# Altium schematic sheet FMC_HPC_400.SchDoc: FMC P1 400 Pin
size A3
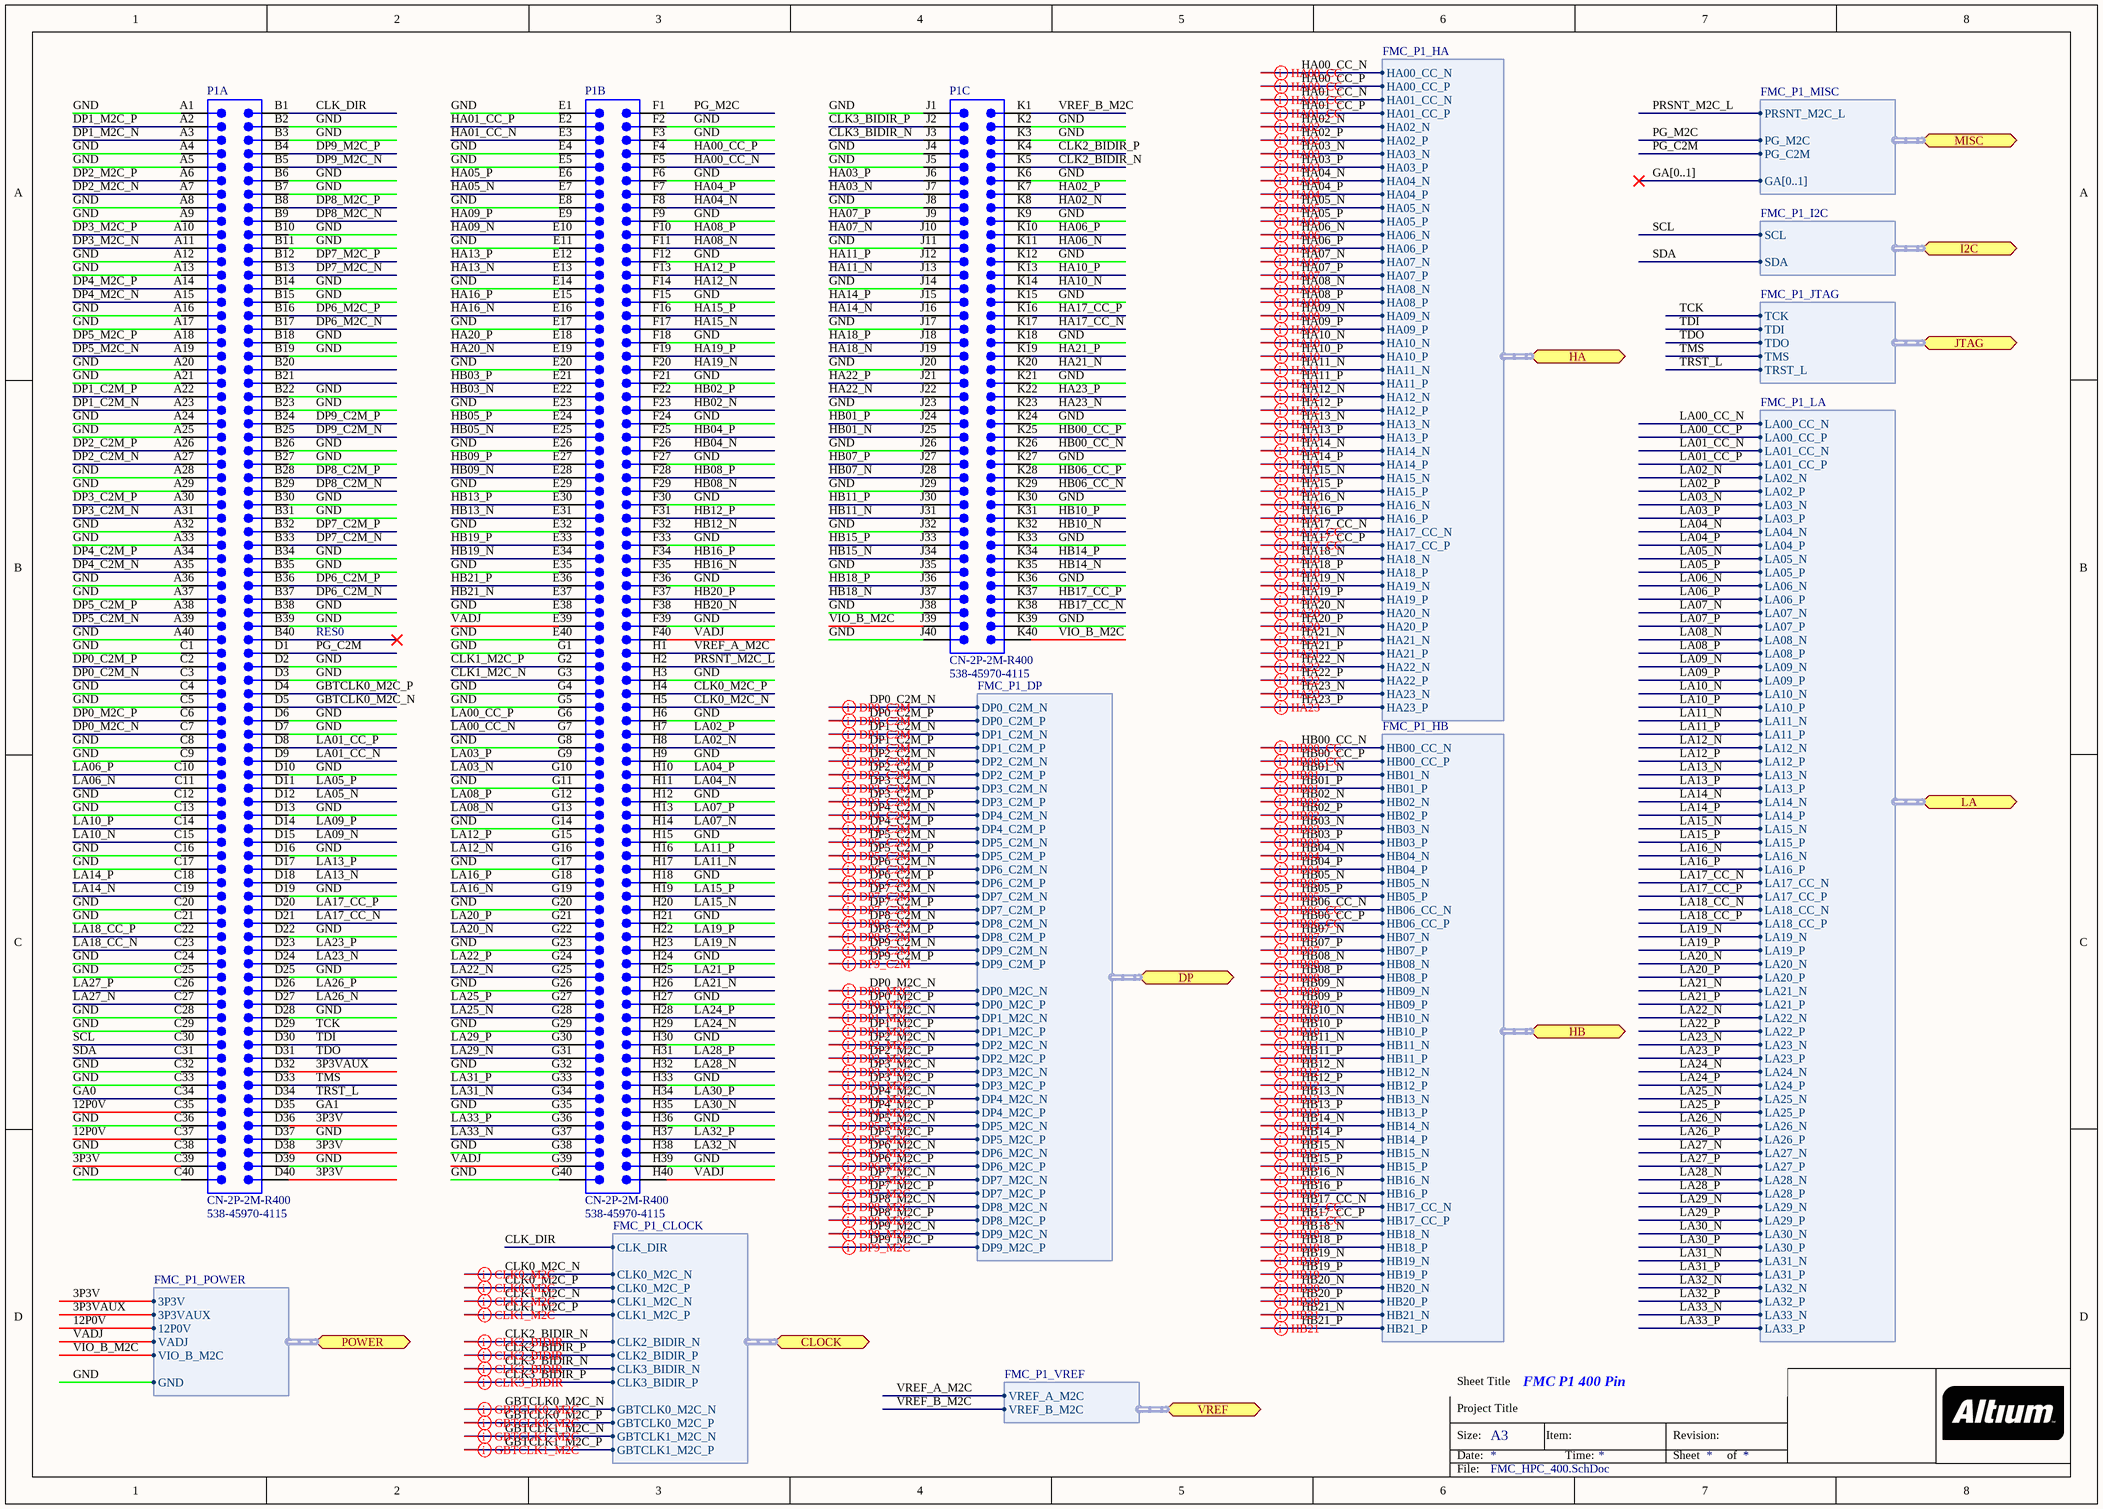
[diagram p0: FMC_HPC_400.SchDoc]

## Parts
P1  CN-2P-2M-R400  Supplier Part Number 1: 538-45970-4115  [BTB-SM1-27-2V400M]  (parts A,B,C of 3)

## Ports
CLOCK (harness FMC_P1_CLOCK), DP (harness FMC_P1_DP), HA (harness FMC_P1_HA), HB (harness FMC_P1_HB), I2C (harness FMC_P1_I2C), JTAG (harness FMC_P1_JTAG), LA (harness FMC_P1_LA), MISC (harness FMC_P1_MISC), POWER (harness FMC_P1_POWER), VREF (harness FMC_P1_VREF)

## Harnesses
FMC_P1_LA: LA05_N, LA05_P, LA06_N, LA06_P, LA09_N, LA09_P, LA10_N, LA10_P, LA13_N, LA13_P, LA14_N, LA14_P, LA23_N, LA23_P, LA26_N, LA26_P, LA27_N, LA27_P, LA02_N, LA02_P, LA03_N, LA03_P, LA04_N, LA04_P, LA07_N, LA07_P, LA08_N, LA08_P, LA11_N, LA11_P, LA12_N, LA12_P, LA15_N, LA15_P, LA16_N, LA16_P, LA19_N, LA19_P, LA20_N, LA20_P, LA21_N, LA21_P, LA22_N, LA22_P, LA24_N, LA24_P, LA25_N, LA25_P, LA28_N, LA28_P, LA29_N, LA29_P, LA30_N, LA30_P, LA31_N, LA31_P, LA32_N, LA32_P, LA33_N, LA33_P, LA00_CC_N, LA00_CC_P, LA01_CC_N, LA01_CC_P, LA17_CC_N, LA17_CC_P, LA18_CC_N, LA18_CC_P
FMC_P1_MISC: PRSNT_M2C_L, PG_M2C, PG_C2M, GA[0..1]
FMC_P1_POWER: 3P3V, 3P3VAUX, 12P0V, VADJ, VIO_B_M2C, GND
FMC_P1_JTAG: TCK, TDI, TDO, TMS, TRST_L
FMC_P1_I2C: SCL, SDA
FMC_P1_CLOCK: CLK2_BIDIR_N, CLK2_BIDIR_P, CLK3_BIDIR_N, CLK3_BIDIR_P, CLK0_M2C_N, CLK0_M2C_P, CLK1_M2C_N, CLK1_M2C_P, CLK_DIR, GBTCLK0_M2C_N, GBTCLK0_M2C_P, GBTCLK1_M2C_N, GBTCLK1_M2C_P
FMC_P1_VREF: VREF_A_M2C, VREF_B_M2C
FMC_P1_HB: HB02_N, HB02_P, HB03_N, HB03_P, HB04_N, HB04_P, HB05_N, HB05_P, HB08_N, HB08_P, HB09_N, HB09_P, HB12_N, HB12_P, HB13_N, HB13_P, HB16_N, HB16_P, HB19_N, HB19_P, HB20_N, HB20_P, HB21_N, HB21_P, HB01_N, HB01_P, HB07_N, HB07_P, HB10_N, HB10_P, HB11_N, HB11_P, HB14_N, HB14_P, HB15_N, HB15_P, HB18_N, HB18_P, HB17_CC_N, HB17_CC_P, HB06_CC_N, HB06_CC_P, HB00_CC_N, HB00_CC_P
FMC_P1_DP: DP1_C2M_N, DP1_C2M_P, DP1_M2C_N, DP1_M2C_P, DP2_C2M_N, DP2_C2M_P, DP2_M2C_N, DP2_M2C_P, DP3_C2M_N, DP3_C2M_P, DP3_M2C_N, DP3_M2C_P, DP4_C2M_N, DP4_C2M_P, DP4_M2C_N, DP4_M2C_P, DP5_C2M_N, DP5_C2M_P, DP5_M2C_N, DP5_M2C_P, DP6_C2M_N, DP6_C2M_P, DP6_M2C_N, DP6_M2C_P, DP7_C2M_N, DP7_C2M_P, DP7_M2C_N, DP7_M2C_P, DP8_C2M_N, DP8_C2M_P, DP8_M2C_N, DP8_M2C_P, DP9_C2M_N, DP9_C2M_P, DP9_M2C_N, DP9_M2C_P, DP0_C2M_N, DP0_C2M_P, DP0_M2C_N, DP0_M2C_P
FMC_P1_HA: HA04_N, HA04_P, HA05_N, HA05_P, HA08_N, HA08_P, HA09_N, HA09_P, HA12_N, HA12_P, HA13_N, HA13_P, HA15_N, HA15_P, HA16_N, HA16_P, HA19_N, HA19_P, HA20_N, HA20_P, HA02_N, HA02_P, HA03_N, HA03_P, HA06_N, HA06_P, HA07_N, HA07_P, HA10_N, HA10_P, HA11_N, HA11_P, HA14_N, HA14_P, HA18_N, HA18_P, HA21_N, HA21_P, HA22_N, HA22_P, HA23_N, HA23_P, HA17_CC_N, HA17_CC_P, HA00_CC_N, HA00_CC_P, HA01_CC_N, HA01_CC_P

## Nets
3P3V: P1.C39 P1.D36 P1.D38 P1.D40 ; port POWER.3P3V
3P3VAUX: P1.D32 ; port POWER.3P3VAUX
12P0V: P1.C35 P1.C37 ; port POWER.12P0V
CLK0_M2C_N: P1.H5 ; port CLOCK.CLK0_M2C_N
CLK0_M2C_P: P1.H4 ; port CLOCK.CLK0_M2C_P
CLK1_M2C_N: P1.G3 ; port CLOCK.CLK1_M2C_N
CLK1_M2C_P: P1.G2 ; port CLOCK.CLK1_M2C_P
CLK2_BIDIR_N: P1.K5 ; port CLOCK.CLK2_BIDIR_N
CLK2_BIDIR_P: P1.K4 ; port CLOCK.CLK2_BIDIR_P
CLK3_BIDIR_N: P1.J3 ; port CLOCK.CLK3_BIDIR_N
CLK3_BIDIR_P: P1.J2 ; port CLOCK.CLK3_BIDIR_P
CLK_DIR: P1.B1 ; port CLOCK.CLK_DIR
DP0_C2M_N: P1.C3 ; port DP.DP0_C2M_N
DP0_C2M_P: P1.C2 ; port DP.DP0_C2M_P
DP0_M2C_N: P1.C7 ; port DP.DP0_M2C_N
DP0_M2C_P: P1.C6 ; port DP.DP0_M2C_P
DP1_C2M_N: P1.A23 ; port DP.DP1_C2M_N
DP1_C2M_P: P1.A22 ; port DP.DP1_C2M_P
DP1_M2C_N: P1.A3 ; port DP.DP1_M2C_N
DP1_M2C_P: P1.A2 ; port DP.DP1_M2C_P
DP2_C2M_N: P1.A27 ; port DP.DP2_C2M_N
DP2_C2M_P: P1.A26 ; port DP.DP2_C2M_P
DP2_M2C_N: P1.A7 ; port DP.DP2_M2C_N
DP2_M2C_P: P1.A6 ; port DP.DP2_M2C_P
DP3_C2M_N: P1.A31 ; port DP.DP3_C2M_N
DP3_C2M_P: P1.A30 ; port DP.DP3_C2M_P
DP3_M2C_N: P1.A11 ; port DP.DP3_M2C_N
DP3_M2C_P: P1.A10 ; port DP.DP3_M2C_P
DP4_C2M_N: P1.A35 ; port DP.DP4_C2M_N
DP4_C2M_P: P1.A34 ; port DP.DP4_C2M_P
DP4_M2C_N: P1.A15 ; port DP.DP4_M2C_N
DP4_M2C_P: P1.A14 ; port DP.DP4_M2C_P
DP5_C2M_N: P1.A39 ; port DP.DP5_C2M_N
DP5_C2M_P: P1.A38 ; port DP.DP5_C2M_P
DP5_M2C_N: P1.A19 ; port DP.DP5_M2C_N
DP5_M2C_P: P1.A18 ; port DP.DP5_M2C_P
DP6_C2M_N: P1.B37 ; port DP.DP6_C2M_N
DP6_C2M_P: P1.B36 ; port DP.DP6_C2M_P
DP6_M2C_N: P1.B17 ; port DP.DP6_M2C_N
DP6_M2C_P: P1.B16 ; port DP.DP6_M2C_P
DP7_C2M_N: P1.B33 ; port DP.DP7_C2M_N
DP7_C2M_P: P1.B32 ; port DP.DP7_C2M_P
DP7_M2C_N: P1.B13 ; port DP.DP7_M2C_N
DP7_M2C_P: P1.B12 ; port DP.DP7_M2C_P
DP8_C2M_N: P1.B29 ; port DP.DP8_C2M_N
DP8_C2M_P: P1.B28 ; port DP.DP8_C2M_P
DP8_M2C_N: P1.B9 ; port DP.DP8_M2C_N
DP8_M2C_P: P1.B8 ; port DP.DP8_M2C_P
DP9_C2M_N: P1.B25 ; port DP.DP9_C2M_N
DP9_C2M_P: P1.B24 ; port DP.DP9_C2M_P
DP9_M2C_N: P1.B5 ; port DP.DP9_M2C_N
DP9_M2C_P: P1.B4 ; port DP.DP9_M2C_P
GA0: P1.C34
GA1: P1.D35
GBTCLK0_M2C_N: P1.D5 ; port CLOCK.GBTCLK0_M2C_N
GBTCLK0_M2C_P: P1.D4 ; port CLOCK.GBTCLK0_M2C_P
GBTCLK1_M2C_N: port CLOCK.GBTCLK1_M2C_N
GBTCLK1_M2C_P: port CLOCK.GBTCLK1_M2C_P
GND: P1.A1 P1.A4 P1.A5 P1.A8 P1.A9 P1.A12 P1.A13 P1.A16 P1.A17 P1.A20 P1.A21 P1.A24 P1.A25 P1.A28 P1.A29 P1.A32 P1.A33 P1.A36 P1.A37 P1.A40 P1.B2 P1.B3 P1.B6 P1.B7 P1.B10 P1.B11 P1.B14 P1.B15 P1.B18 P1.B19 P1.B22 P1.B23 P1.B26 P1.B27 P1.B30 P1.B31 P1.B34 P1.B35 P1.B38 P1.B39 P1.C1 P1.C4 P1.C5 P1.C8 P1.C9 P1.C12 P1.C13 P1.C16 P1.C17 P1.C20 P1.C21 P1.C24 P1.C25 P1.C28 P1.C29 P1.C32 P1.C33 P1.C36 P1.C38 P1.C40 P1.D2 P1.D3 P1.D6 P1.D7 P1.D10 P1.D13 P1.D16 P1.D19 P1.D22 P1.D25 P1.D28 P1.D37 P1.D39 P1.E1 P1.E4 P1.E5 P1.E8 P1.E11 P1.E14 P1.E17 P1.E20 P1.E23 P1.E26 P1.E29 P1.E32 P1.E35 P1.E38 P1.E40 P1.F2 P1.F3 P1.F6 P1.F9 P1.F12 P1.F15 P1.F18 P1.F21 P1.F24 P1.F27 P1.F30 P1.F33 P1.F36 P1.F39 P1.G1 P1.G4 P1.G5 P1.G8 P1.G11 P1.G14 P1.G17 P1.G20 P1.G23 P1.G26 P1.G29 P1.G32 P1.G35 P1.G38 P1.G40 P1.H3 P1.H6 P1.H9 P1.H12 P1.H15 P1.H18 P1.H21 P1.H24 P1.H27 P1.H30 P1.H33 P1.H36 P1.H39 P1.J1 P1.J4 P1.J5 P1.J8 P1.J11 P1.J14 P1.J17 P1.J20 P1.J23 P1.J26 P1.J29 P1.J32 P1.J35 P1.J38 P1.J40 P1.K2 P1.K3 P1.K6 P1.K9 P1.K12 P1.K15 P1.K18 P1.K21 P1.K24 P1.K27 P1.K30 P1.K33 P1.K36 P1.K39 ; port POWER.GND
HA00_CC_N: P1.F5 ; port HA.HA00_CC_N
HA00_CC_P: P1.F4 ; port HA.HA00_CC_P
HA01_CC_N: P1.E3 ; port HA.HA01_CC_N
HA01_CC_P: P1.E2 ; port HA.HA01_CC_P
HA02_N: P1.K8 ; port HA.HA02_N
HA02_P: P1.K7 ; port HA.HA02_P
HA03_N: P1.J7 ; port HA.HA03_N
HA03_P: P1.J6 ; port HA.HA03_P
HA04_N: P1.F8 ; port HA.HA04_N
HA04_P: P1.F7 ; port HA.HA04_P
HA05_N: P1.E7 ; port HA.HA05_N
HA05_P: P1.E6 ; port HA.HA05_P
HA06_N: P1.K11 ; port HA.HA06_N
HA06_P: P1.K10 ; port HA.HA06_P
HA07_N: P1.J10 ; port HA.HA07_N
HA07_P: P1.J9 ; port HA.HA07_P
HA08_N: P1.F11 ; port HA.HA08_N
HA08_P: P1.F10 ; port HA.HA08_P
HA09_N: P1.E10 ; port HA.HA09_N
HA09_P: P1.E9 ; port HA.HA09_P
HA10_N: P1.K14 ; port HA.HA10_N
HA10_P: P1.K13 ; port HA.HA10_P
HA11_N: P1.J13 ; port HA.HA11_N
HA11_P: P1.J12 ; port HA.HA11_P
HA12_N: P1.F14 ; port HA.HA12_N
HA12_P: P1.F13 ; port HA.HA12_P
HA13_N: P1.E13 ; port HA.HA13_N
HA13_P: P1.E12 ; port HA.HA13_P
HA14_N: P1.J16 ; port HA.HA14_N
HA14_P: P1.J15 ; port HA.HA14_P
HA15_N: P1.F17 ; port HA.HA15_N
HA15_P: P1.F16 ; port HA.HA15_P
HA16_N: P1.E16 ; port HA.HA16_N
HA16_P: P1.E15 ; port HA.HA16_P
HA17_CC_N: P1.K17 ; port HA.HA17_CC_N
HA17_CC_P: P1.K16 ; port HA.HA17_CC_P
HA18_N: P1.J19 ; port HA.HA18_N
HA18_P: P1.J18 ; port HA.HA18_P
HA19_N: P1.F20 ; port HA.HA19_N
HA19_P: P1.F19 ; port HA.HA19_P
HA20_N: P1.E19 ; port HA.HA20_N
HA20_P: P1.E18 ; port HA.HA20_P
HA21_N: P1.K20 ; port HA.HA21_N
HA21_P: P1.K19 ; port HA.HA21_P
HA22_N: P1.J22 ; port HA.HA22_N
HA22_P: P1.J21 ; port HA.HA22_P
HA23_N: P1.K23 ; port HA.HA23_N
HA23_P: P1.K22 ; port HA.HA23_P
HB00_CC_N: P1.K26 ; port HB.HB00_CC_N
HB00_CC_P: P1.K25 ; port HB.HB00_CC_P
HB01_N: P1.J25 ; port HB.HB01_N
HB01_P: P1.J24 ; port HB.HB01_P
HB02_N: P1.F23 ; port HB.HB02_N
HB02_P: P1.F22 ; port HB.HB02_P
HB03_N: P1.E22 ; port HB.HB03_N
HB03_P: P1.E21 ; port HB.HB03_P
HB04_N: P1.F26 ; port HB.HB04_N
HB04_P: P1.F25 ; port HB.HB04_P
HB05_N: P1.E25 ; port HB.HB05_N
HB05_P: P1.E24 ; port HB.HB05_P
HB06_CC_N: P1.K29 ; port HB.HB06_CC_N
HB06_CC_P: P1.K28 ; port HB.HB06_CC_P
HB07_N: P1.J28 ; port HB.HB07_N
HB07_P: P1.J27 ; port HB.HB07_P
HB08_N: P1.F29 ; port HB.HB08_N
HB08_P: P1.F28 ; port HB.HB08_P
HB09_N: P1.E28 ; port HB.HB09_N
HB09_P: P1.E27 ; port HB.HB09_P
HB10_N: P1.K32 ; port HB.HB10_N
HB10_P: P1.K31 ; port HB.HB10_P
HB11_N: P1.J31 ; port HB.HB11_N
HB11_P: P1.J30 ; port HB.HB11_P
HB12_N: P1.F32 ; port HB.HB12_N
HB12_P: P1.F31 ; port HB.HB12_P
HB13_N: P1.E31 ; port HB.HB13_N
HB13_P: P1.E30 ; port HB.HB13_P
HB14_N: P1.K35 ; port HB.HB14_N
HB14_P: P1.K34 ; port HB.HB14_P
HB15_N: P1.J34 ; port HB.HB15_N
HB15_P: P1.J33 ; port HB.HB15_P
HB16_N: P1.F35 ; port HB.HB16_N
HB16_P: P1.F34 ; port HB.HB16_P
HB17_CC_N: P1.K38 ; port HB.HB17_CC_N
HB17_CC_P: P1.K37 ; port HB.HB17_CC_P
HB18_N: P1.J37 ; port HB.HB18_N
HB18_P: P1.J36 ; port HB.HB18_P
HB19_N: P1.E34 ; port HB.HB19_N
HB19_P: P1.E33 ; port HB.HB19_P
HB20_N: P1.F38 ; port HB.HB20_N
HB20_P: P1.F37 ; port HB.HB20_P
HB21_N: P1.E37 ; port HB.HB21_N
HB21_P: P1.E36 ; port HB.HB21_P
LA00_CC_N: P1.G7 ; port LA.LA00_CC_N
LA00_CC_P: P1.G6 ; port LA.LA00_CC_P
LA01_CC_N: P1.D9 ; port LA.LA01_CC_N
LA01_CC_P: P1.D8 ; port LA.LA01_CC_P
LA02_N: P1.H8 ; port LA.LA02_N
LA02_P: P1.H7 ; port LA.LA02_P
LA03_N: P1.G10 ; port LA.LA03_N
LA03_P: P1.G9 ; port LA.LA03_P
LA04_N: P1.H11 ; port LA.LA04_N
LA04_P: P1.H10 ; port LA.LA04_P
LA05_N: P1.D12 ; port LA.LA05_N
LA05_P: P1.D11 ; port LA.LA05_P
LA06_N: P1.C11 ; port LA.LA06_N
LA06_P: P1.C10 ; port LA.LA06_P
LA07_N: P1.H14 ; port LA.LA07_N
LA07_P: P1.H13 ; port LA.LA07_P
LA08_N: P1.G13 ; port LA.LA08_N
LA08_P: P1.G12 ; port LA.LA08_P
LA09_N: P1.D15 ; port LA.LA09_N
LA09_P: P1.D14 ; port LA.LA09_P
LA10_N: P1.C15 ; port LA.LA10_N
LA10_P: P1.C14 ; port LA.LA10_P
LA11_N: P1.H17 ; port LA.LA11_N
LA11_P: P1.H16 ; port LA.LA11_P
LA12_N: P1.G16 ; port LA.LA12_N
LA12_P: P1.G15 ; port LA.LA12_P
LA13_N: P1.D18 ; port LA.LA13_N
LA13_P: P1.D17 ; port LA.LA13_P
LA14_N: P1.C19 ; port LA.LA14_N
LA14_P: P1.C18 ; port LA.LA14_P
LA15_N: P1.H20 ; port LA.LA15_N
LA15_P: P1.H19 ; port LA.LA15_P
LA16_N: P1.G19 ; port LA.LA16_N
LA16_P: P1.G18 ; port LA.LA16_P
LA17_CC_N: P1.D21 ; port LA.LA17_CC_N
LA17_CC_P: P1.D20 ; port LA.LA17_CC_P
LA18_CC_N: P1.C23 ; port LA.LA18_CC_N
LA18_CC_P: P1.C22 ; port LA.LA18_CC_P
LA19_N: P1.H23 ; port LA.LA19_N
LA19_P: P1.H22 ; port LA.LA19_P
LA20_N: P1.G22 ; port LA.LA20_N
LA20_P: P1.G21 ; port LA.LA20_P
LA21_N: P1.H26 ; port LA.LA21_N
LA21_P: P1.H25 ; port LA.LA21_P
LA22_N: P1.G25 ; port LA.LA22_N
LA22_P: P1.G24 ; port LA.LA22_P
LA23_N: P1.D24 ; port LA.LA23_N
LA23_P: P1.D23 ; port LA.LA23_P
LA24_N: P1.H29 ; port LA.LA24_N
LA24_P: P1.H28 ; port LA.LA24_P
LA25_N: P1.G28 ; port LA.LA25_N
LA25_P: P1.G27 ; port LA.LA25_P
LA26_N: P1.D27 ; port LA.LA26_N
LA26_P: P1.D26 ; port LA.LA26_P
LA27_N: P1.C27 ; port LA.LA27_N
LA27_P: P1.C26 ; port LA.LA27_P
LA28_N: P1.H32 ; port LA.LA28_N
LA28_P: P1.H31 ; port LA.LA28_P
LA29_N: P1.G31 ; port LA.LA29_N
LA29_P: P1.G30 ; port LA.LA29_P
LA30_N: P1.H35 ; port LA.LA30_N
LA30_P: P1.H34 ; port LA.LA30_P
LA31_N: P1.G34 ; port LA.LA31_N
LA31_P: P1.G33 ; port LA.LA31_P
LA32_N: P1.H38 ; port LA.LA32_N
LA32_P: P1.H37 ; port LA.LA32_P
LA33_N: P1.G37 ; port LA.LA33_N
LA33_P: P1.G36 ; port LA.LA33_P
PG_C2M: P1.D1 ; port MISC.PG_C2M
PG_M2C: P1.F1 ; port MISC.PG_M2C
PRSNT_M2C_L: P1.H2 ; port MISC.PRSNT_M2C_L
SCL: P1.C30 ; port I2C.SCL
SDA: P1.C31 ; port I2C.SDA
TCK: P1.D29 ; port JTAG.TCK
TDI: P1.D30 ; port JTAG.TDI
TDO: P1.D31 ; port JTAG.TDO
TMS: P1.D33 ; port JTAG.TMS
TRST_L: P1.D34 ; port JTAG.TRST_L
VADJ: P1.E39 P1.F40 P1.G39 P1.H40 ; port POWER.VADJ
VIO_B_M2C: P1.J39 P1.K40 ; port POWER.VIO_B_M2C
VREF_A_M2C: P1.H1 ; port VREF.VREF_A_M2C
VREF_B_M2C: P1.K1 ; port VREF.VREF_B_M2C

Not connected (* = marked no-connect by the designer): P1 B20 B21 B40*

## Buses and harness runs
bus GA[0..1]

## Layout directives
differential pair: CLK0_M2C_N, CLK0_M2C_P, CLK1_M2C_N, CLK1_M2C_P, CLK2_BIDIR_N, CLK2_BIDIR_P, CLK3_BIDIR_N, CLK3_BIDIR_P, DP0_C2M_N, DP0_C2M_P, DP0_M2C_N, DP0_M2C_P, DP1_C2M_N, DP1_C2M_P, DP1_M2C_N, DP1_M2C_P, DP2_C2M_N, DP2_C2M_P, DP2_M2C_N, DP2_M2C_P, DP3_C2M_N, DP3_C2M_P, DP3_M2C_N, DP3_M2C_P, DP4_C2M_N, DP4_C2M_P, DP4_M2C_N, DP4_M2C_P, DP5_C2M_N, DP5_C2M_P, DP5_M2C_N, DP5_M2C_P, DP6_C2M_N, DP6_C2M_P, DP6_M2C_N, DP6_M2C_P, DP7_C2M_N, DP7_C2M_P, DP7_M2C_N, DP7_M2C_P, DP8_C2M_N, DP8_C2M_P, DP8_M2C_N, DP8_M2C_P, DP9_C2M_N, DP9_C2M_P, DP9_M2C_N, DP9_M2C_P, GBTCLK0_M2C_N, GBTCLK0_M2C_P, GBTCLK1_M2C_N, GBTCLK1_M2C_P, HA00_CC_N, HA00_CC_P, HA01_CC_N, HA01_CC_P, HA02_N, HA02_P, HA03_N, HA03_P, HA04_N, HA04_P, HA05_N, HA05_P, HA06_N, HA06_P, HA07_N, HA07_P, HA08_N, HA08_P, HA09_N, HA09_P, HA10_N, HA10_P, HA11_N, HA11_P, HA12_N, HA12_P, HA13_N, HA13_P, HA14_N, HA14_P, HA15_N, HA15_P, HA16_N, HA16_P, HA17_CC_N, HA17_CC_P, HA18_N, HA18_P, HA19_N, HA19_P, HA20_N, HA20_P, HA21_N, HA21_P, HA22_N, HA22_P, HA23_N, HA23_P, HB00_CC_N, HB00_CC_P, HB01_N, HB01_P, HB02_N, HB02_P, HB03_N, HB03_P, HB04_N, HB04_P, HB05_N, HB05_P, HB06_CC_N, HB06_CC_P, HB07_N, HB07_P, HB08_N, HB08_P, HB09_N, HB09_P, HB10_N, HB10_P, HB11_N, HB11_P, HB12_N, HB12_P, HB13_N, HB13_P, HB14_N, HB14_P, HB15_N, HB15_P, HB16_N, HB16_P, HB17_CC_N, HB17_CC_P, HB18_N, HB18_P, HB19_N, HB19_P, HB20_N, HB20_P, HB21_N, HB21_P

## Notes on the sheet
- RES0
- Sheet Title
- Project Title
- Size:
- Date:
- A3
- Item:
- Time:
- Revision:
- Sheet
- of
- File:

## Library data of the parts
P1 = CN-2P-2M-R400: Board-to-Board Connector, Vertical, 10-Row, Pitch 1.27mm, 400-Position; Manufacturer: Molex; Manufacturer Part Number: 45970-4115; Current Rating: 2.7 A; Voltage Rating: 240 V; Number of Positions / Contacts: 400; Supplier 1: Mouser; RoHS: RoHS Compliant; Category: Board to Board & Mezzanine Connectors; Stock 1: 161; Pricing 1: 1=36.56, 10=32.14, 100=28.08, 300=26.87 (USD); Contact Plating: Gold; Housing Material: Thermoplastic; Mounting Angle: Vertical; Number of Rows: 10; Packaging: Reel; Series: 45970; Termination Style: SMD; Brand: Molex; Contact Material: Copper Alloy; Pitch: 1.27 mm; Product Category: Mezzanine Connectors; Product Type: Plugs; Standard Pack Qty: 300; Tradename: SEARAY; RoHS - Mouser: Y; Minimum Order Quantity: 1; Reeling: True; ComponentLink1URL: http://www.mouser.com/ds/2/276/0459704115_PCB_HEADERS-169229.pdf; ComponentLink1Description: http://www.mouser.com/ds/2/276/0459704115_PCB_HEADERS-169229.pdf